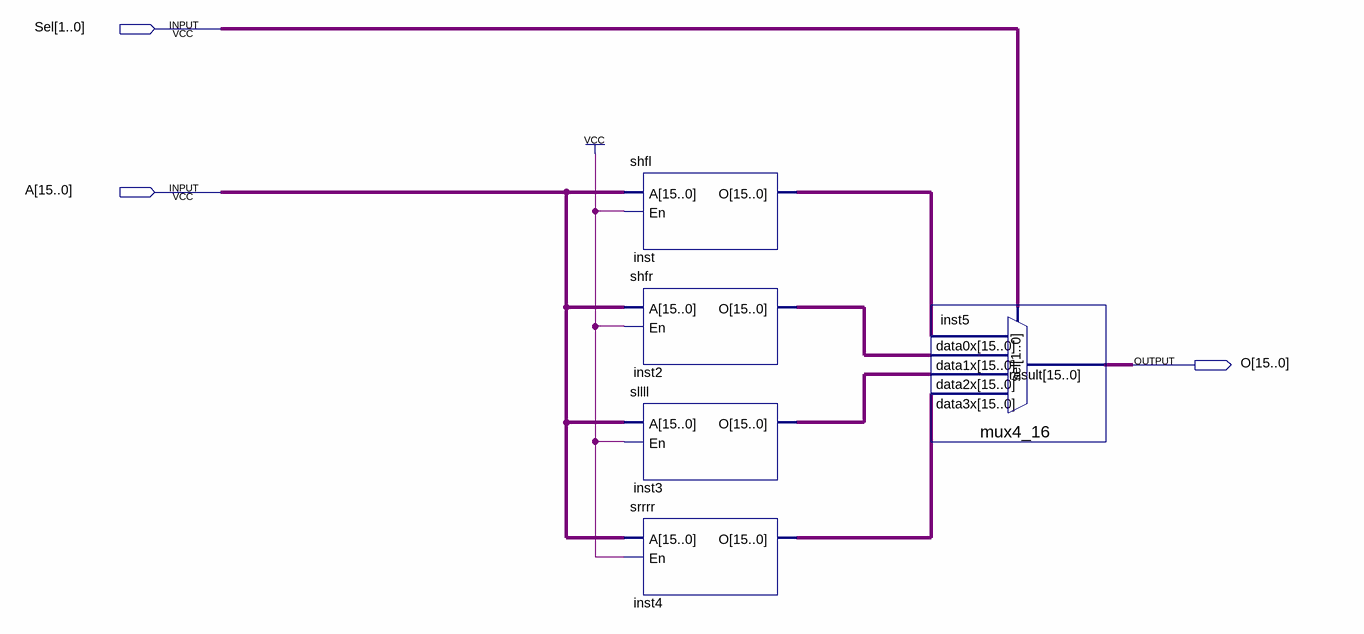
[diagram p0: schematic sheet]
// Quartus schematic Not_ALU3.bdf as structural Verilog: 5 symbols, 3 pins
module Not_ALU3 (
  input  [1:0] Sel,
  input  [15:0] A,
  output [15:0] O
);

  wire [15:0] inst2_o, inst3_o, inst4_o, inst_o;

  shfl inst (.A(A), .En(1'b1), .O(inst_o));
  shfr inst2 (.A(A), .En(1'b1), .O(inst2_o));
  sllll inst3 (.A(A), .En(1'b1), .O(inst3_o));
  srrrr inst4 (.A(A), .En(1'b1), .O(inst4_o));
  mux4_16 inst5 (.data3x(inst4_o), .data2x(inst3_o), .data1x(inst2_o), .data0x(inst_o), .sel(Sel), .result(O));
endmodule
